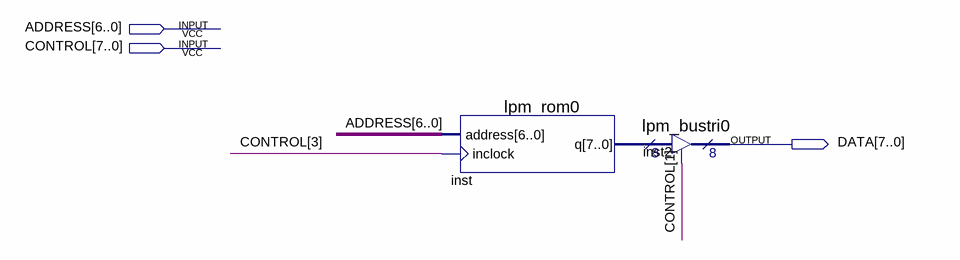
[diagram p0: schematic sheet]
// Quartus schematic ROM.bdf as structural Verilog: 2 symbols, 3 pins
module ROM (
  input  [6:0] ADDRESS,
  input  [7:0] CONTROL,
  output [7:0] DATA
);

  wire [7:0] inst_q;

  lpm_rom0 inst (.address(ADDRESS), .inclock(CONTROL[3]), .q(inst_q));
  lpm_bustri0 inst2 (.enabledt(CONTROL[1]), .data(inst_q), .tridata(DATA));
endmodule
